# Altium project johnson_noise.PrjPcb
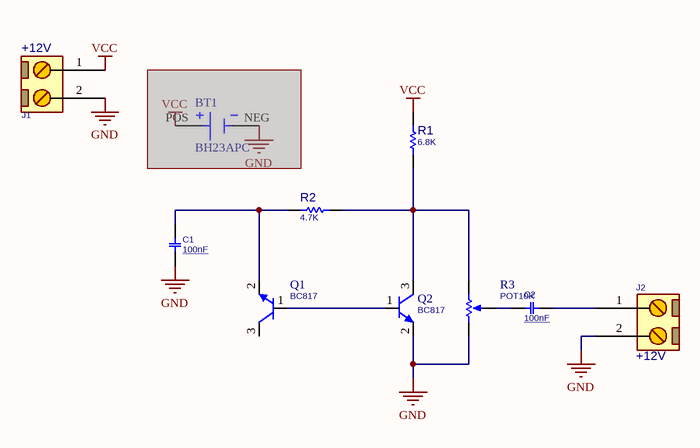
[diagram p0: Sheet1.SchDoc]
1 sheet, 10 parts. Net scope: global (net labels, ports and power ports of the same name join across sheets).
Board file: PCB1.PcbDoc

## Sheet Sheet1.SchDoc
size A4; SheetNumber: 1; SheetTotal: 1

### Parts
BT1  BH23APC  [BAT_BH23APC]  (masked out: inside a compile mask, not in the netlist)
C1  100nF  [C0805]
C2  100nF  [C0805]
J1  +12V  [MSTB_2]
J2  +12V  [MSTB_2]
Q1  BC817  [SOT23_3]
Q2  BC817  [SOT23_3]
R1  6.8K  [R0805]
R2  4.7K  [R0805]
R3  POT10K  [VOL_R]

### Nets
GND: C1.1 J1.2 J2.2 Q2.2(E) R3.1(TOP)
VCC: J1.1 R1.2
NetC1_2: C1.2 Q1.2(E) R2.2
NetC2_1: C2.1 R3.2(TAP)
NetC2_2: C2.2 J2.1
NetQ1_1: Q1.1(B) Q2.1(B)
NetQ2_3: Q2.3(C) R1.1 R2.1 R3.3(BOT)

Not connected (* = marked no-connect by the designer): Q1 3(C)

### Library data of the parts
BT1 = BH23APC: BATTERY HOLDER A23 PC PIN; MF: MPD; Package: None; Price: None; Value: *; SnapEDA_Link: https://www.snapeda.com/parts/BH23APC/MPD/view-part/4389073/?ref=snap; MP: BH23APC; Availability: Unavailable
C1 C2 = CAP_SMD_MLCC_0805: CAP, MLCC, -F, -V, MATERIAL, -%, 0201; PARAM: -, -%; MANF_P#: MANF_PART#; PRICE: 100= 1$; MANF: -; PARAM2: -V; ASSEMBLY: ASSEMBLY; VALUE: 100nF
J1 J2 = CONN_MSTB_2: CONN, PHOENIX MSTB, 5-G, 5.08mm pitch; VALUE: CONN_TB2
Q1 Q2 = NPN_BC817_SOT23: BJT, NPN, 45v, 0.5A, SMD, SOT23; PARAM: 0.5A, Hfe100~600; PARAM2: 45v, 250mW; MANF: NXP, ON; MANF_P#: BC817; VALUE: BC817
R1 R2 = RES_SMD_0805: RESISTOR, SMD; PARAM: -W; DESC: DESCRIPTION; DIST#: MOUSER; PARAM2: 1%; MANF_P#: -; MANF: -; ASSEMBLY: ASSEMBLY; PRICE: 100= 0.5$
  R1: VALUE: 6.8K
  R2: VALUE: 4.7K
R3 = RES_THD_POT_VOL: RESISTOR, THD, Potentiometer Volume; VALUE: POT10K